# EAGLE schematic lower_pcb (EAGLE 9.6.2)
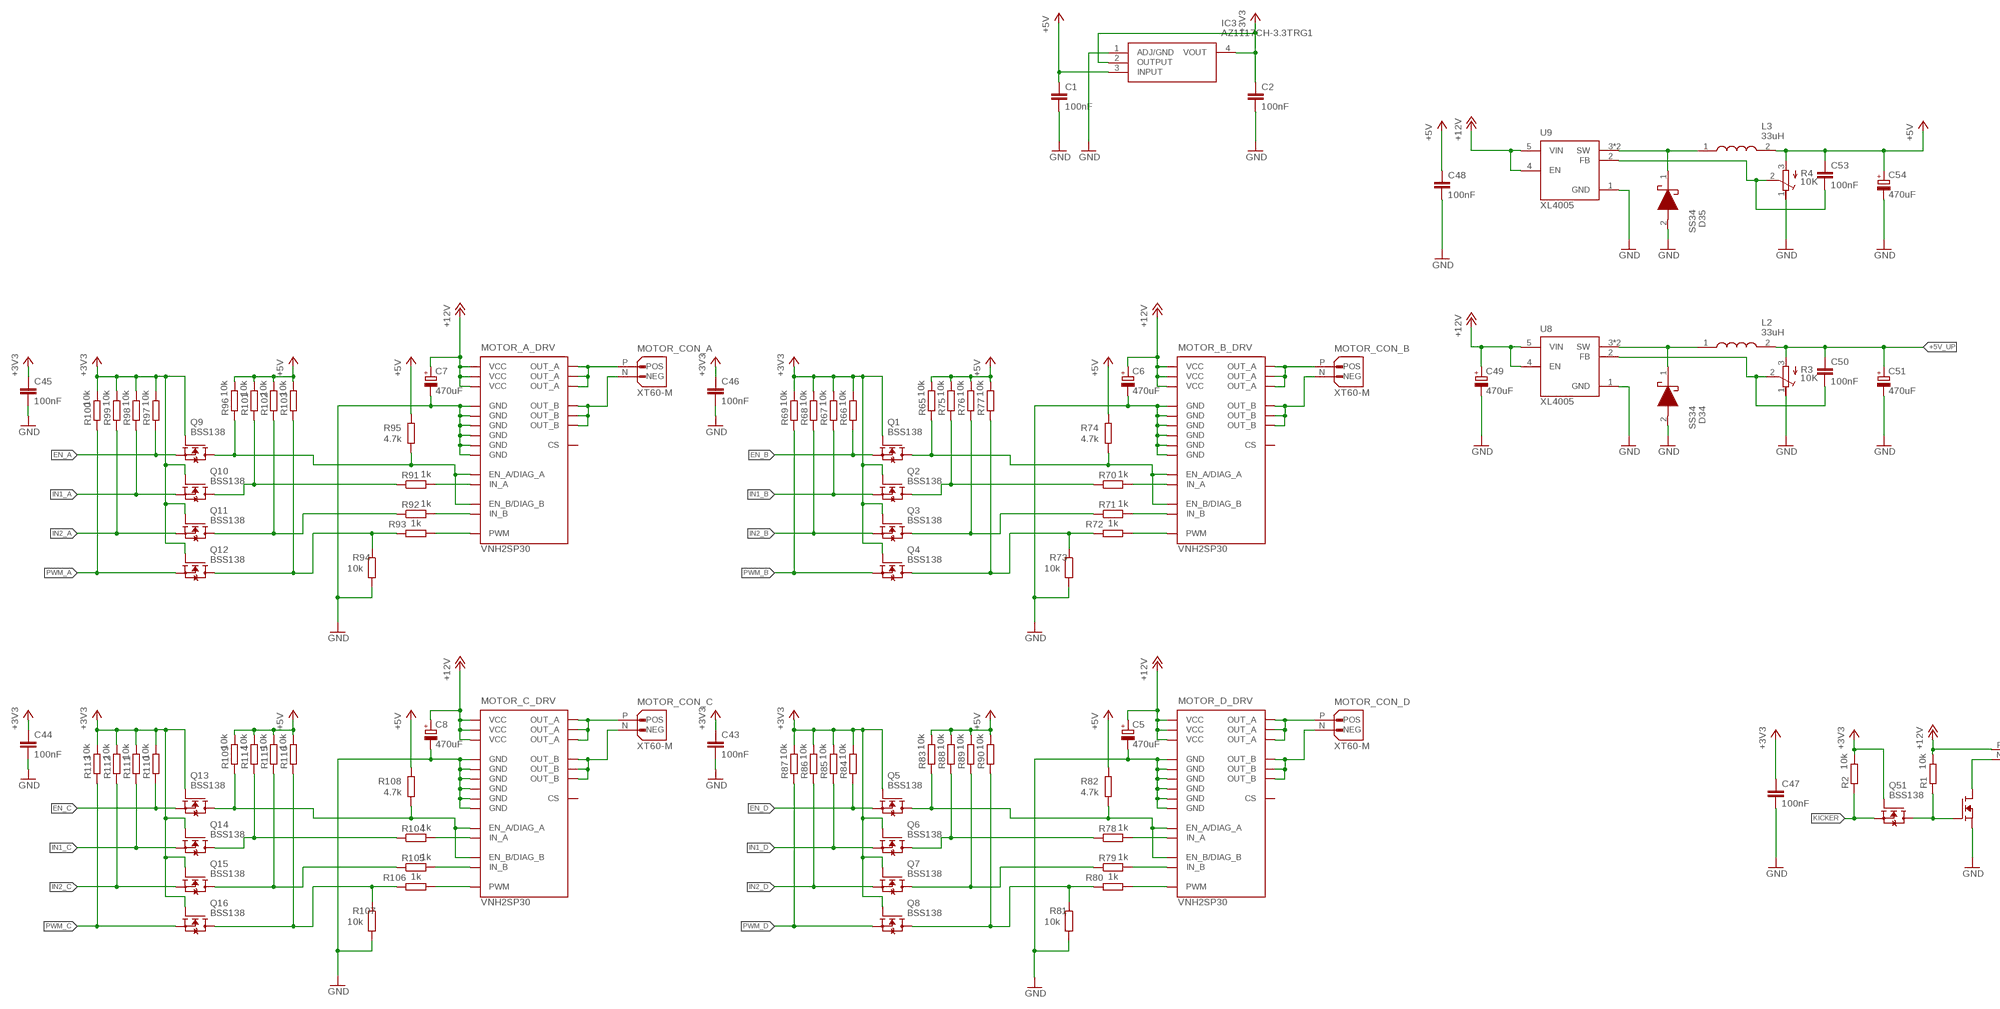
[diagram p0: schematic, sheet 1, part 1 of 2]
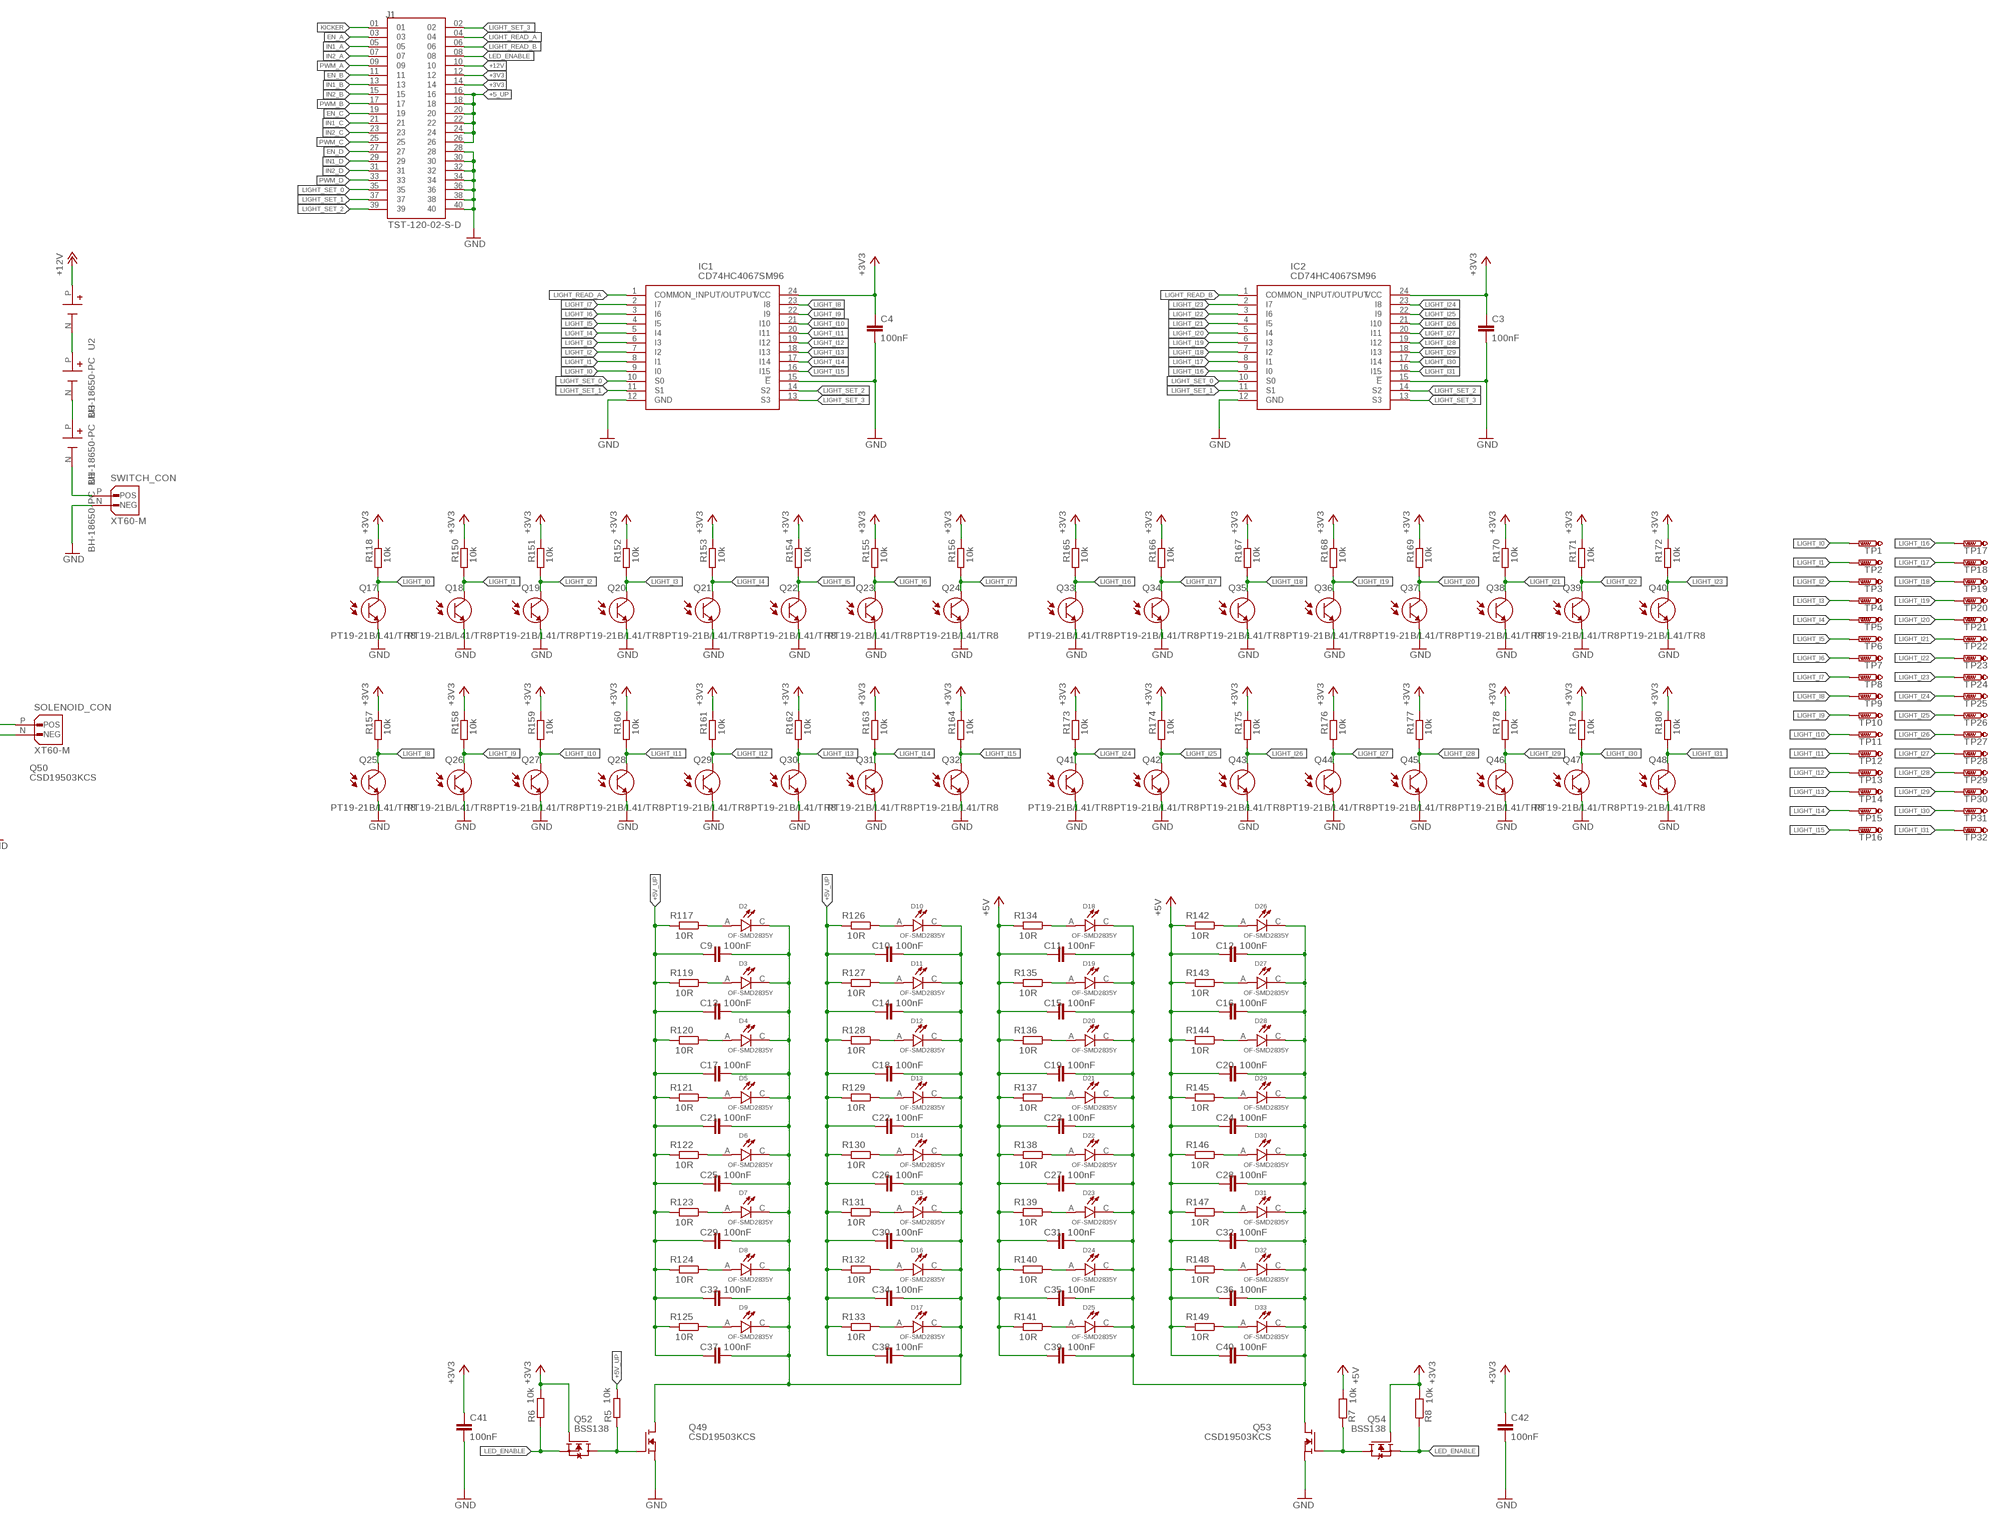
[diagram p1: schematic, sheet 1, part 2 of 2]

## Parts
C1  100nF  C-EUC0805  [C0805]
C2  100nF  C-EUC0805  [C0805]
C3  100nF  C-EUC0805  [C0805]
C4  100nF  C-EUC0805  [C0805]
C5  470uF  CPOL-EU150CLZ-1010  [150CLZ-1010]
C6  470uF  CPOL-EU150CLZ-1010  [150CLZ-1010]
C7  470uF  CPOL-EU150CLZ-1010  [150CLZ-1010]
C8  470uF  CPOL-EU150CLZ-1010  [150CLZ-1010]
C9  100nF  C-EUC0805  [C0805]
C10  100nF  C-EUC0805  [C0805]
C11  100nF  C-EUC0805  [C0805]
C12  100nF  C-EUC0805  [C0805]
C13  100nF  C-EUC0805  [C0805]
C14  100nF  C-EUC0805  [C0805]
C15  100nF  C-EUC0805  [C0805]
C16  100nF  C-EUC0805  [C0805]
C17  100nF  C-EUC0805  [C0805]
C18  100nF  C-EUC0805  [C0805]
C19  100nF  C-EUC0805  [C0805]
C20  100nF  C-EUC0805  [C0805]
C21  100nF  C-EUC0805  [C0805]
C22  100nF  C-EUC0805  [C0805]
C23  100nF  C-EUC0805  [C0805]
C24  100nF  C-EUC0805  [C0805]
C25  100nF  C-EUC0805  [C0805]
C26  100nF  C-EUC0805  [C0805]
C27  100nF  C-EUC0805  [C0805]
C28  100nF  C-EUC0805  [C0805]
C29  100nF  C-EUC0805  [C0805]
C30  100nF  C-EUC0805  [C0805]
C31  100nF  C-EUC0805  [C0805]
C32  100nF  C-EUC0805  [C0805]
C33  100nF  C-EUC0805  [C0805]
C34  100nF  C-EUC0805  [C0805]
C35  100nF  C-EUC0805  [C0805]
C36  100nF  C-EUC0805  [C0805]
C37  100nF  C-EUC0805  [C0805]
C38  100nF  C-EUC0805  [C0805]
C39  100nF  C-EUC0805  [C0805]
C40  100nF  C-EUC0805  [C0805]
C41  100nF  C-EUC0805  [C0805]
C42  100nF  C-EUC0805  [C0805]
C43  100nF  C-EUC0805  [C0805]
C44  100nF  C-EUC0805  [C0805]
C45  100nF  C-EUC0805  [C0805]
C46  100nF  C-EUC0805  [C0805]
C47  100nF  C-EUC0805  [C0805]
C48  100nF  C-EUC0805  [C0805]
C49  470uF  CPOL-EU150CLZ-1010  [150CLZ-1010]
C50  100nF  C-EUC0805  [C0805]
C51  470uF  CPOL-EU150CLZ-1010  [150CLZ-1010]
C53  100nF  C-EUC0805  [C0805]
C54  470uF  CPOL-EU150CLZ-1010  [150CLZ-1010]
D2  OF-SMD2835Y  [LED_OF-SMD2835Y]
D3  OF-SMD2835Y  [LED_OF-SMD2835Y]
D4  OF-SMD2835Y  [LED_OF-SMD2835Y]
D5  OF-SMD2835Y  [LED_OF-SMD2835Y]
D6  OF-SMD2835Y  [LED_OF-SMD2835Y]
D7  OF-SMD2835Y  [LED_OF-SMD2835Y]
D8  OF-SMD2835Y  [LED_OF-SMD2835Y]
D9  OF-SMD2835Y  [LED_OF-SMD2835Y]
D10  OF-SMD2835Y  [LED_OF-SMD2835Y]
D11  OF-SMD2835Y  [LED_OF-SMD2835Y]
D12  OF-SMD2835Y  [LED_OF-SMD2835Y]
D13  OF-SMD2835Y  [LED_OF-SMD2835Y]
D14  OF-SMD2835Y  [LED_OF-SMD2835Y]
D15  OF-SMD2835Y  [LED_OF-SMD2835Y]
D16  OF-SMD2835Y  [LED_OF-SMD2835Y]
D17  OF-SMD2835Y  [LED_OF-SMD2835Y]
D18  OF-SMD2835Y  [LED_OF-SMD2835Y]
D19  OF-SMD2835Y  [LED_OF-SMD2835Y]
D20  OF-SMD2835Y  [LED_OF-SMD2835Y]
D21  OF-SMD2835Y  [LED_OF-SMD2835Y]
D22  OF-SMD2835Y  [LED_OF-SMD2835Y]
D23  OF-SMD2835Y  [LED_OF-SMD2835Y]
D24  OF-SMD2835Y  [LED_OF-SMD2835Y]
D25  OF-SMD2835Y  [LED_OF-SMD2835Y]
D26  OF-SMD2835Y  [LED_OF-SMD2835Y]
D27  OF-SMD2835Y  [LED_OF-SMD2835Y]
D28  OF-SMD2835Y  [LED_OF-SMD2835Y]
D29  OF-SMD2835Y  [LED_OF-SMD2835Y]
D30  OF-SMD2835Y  [LED_OF-SMD2835Y]
D31  OF-SMD2835Y  [LED_OF-SMD2835Y]
D32  OF-SMD2835Y  [LED_OF-SMD2835Y]
D33  OF-SMD2835Y  [LED_OF-SMD2835Y]
D34  SS34  [DIOM8059X256N]
D35  SS34  [DIOM8059X256N]
IC1  CD74HC4067SM96  [SOP65P780X200-24N]
IC2  CD74HC4067SM96  [SOP65P780X200-24N]
IC3  AZ1117CH-3.3TRG1  [SOT230P700X180-4N]
J1  TST-120-02-S-D  [SAMTEC_TST-120-02-S-D]
L2  33uH  7443551151  [WE-HCI_1350/136523]
L3  33uH  7443551151  [WE-HCI_1350/136523]
MOTOR_A_DRV  VNH2SP30  [MULTIPOWER30]
MOTOR_B_DRV  VNH2SP30  [MULTIPOWER30]
MOTOR_C_DRV  VNH2SP30  [MULTIPOWER30]
MOTOR_CON_A  XT60-M  [AMASS_XT60-M]
MOTOR_CON_B  XT60-M  [AMASS_XT60-M]
MOTOR_CON_C  XT60-M  [AMASS_XT60-M]
MOTOR_CON_D  XT60-M  [AMASS_XT60-M]
MOTOR_D_DRV  VNH2SP30  [MULTIPOWER30]
Q1  BSS138  [SOT95P240X111-3N]
Q2  BSS138  [SOT95P240X111-3N]
Q3  BSS138  [SOT95P240X111-3N]
Q4  BSS138  [SOT95P240X111-3N]
Q5  BSS138  [SOT95P240X111-3N]
Q6  BSS138  [SOT95P240X111-3N]
Q7  BSS138  [SOT95P240X111-3N]
Q8  BSS138  [SOT95P240X111-3N]
Q9  BSS138  [SOT95P240X111-3N]
Q10  BSS138  [SOT95P240X111-3N]
Q11  BSS138  [SOT95P240X111-3N]
Q12  BSS138  [SOT95P240X111-3N]
Q13  BSS138  [SOT95P240X111-3N]
Q14  BSS138  [SOT95P240X111-3N]
Q15  BSS138  [SOT95P240X111-3N]
Q16  BSS138  [SOT95P240X111-3N]
Q17  PT19-21B/L41/TR8  [XDCR_PT19-21B/L41/TR8]
Q18  PT19-21B/L41/TR8  [XDCR_PT19-21B/L41/TR8]
Q19  PT19-21B/L41/TR8  [XDCR_PT19-21B/L41/TR8]
Q20  PT19-21B/L41/TR8  [XDCR_PT19-21B/L41/TR8]
Q21  PT19-21B/L41/TR8  [XDCR_PT19-21B/L41/TR8]
Q22  PT19-21B/L41/TR8  [XDCR_PT19-21B/L41/TR8]
Q23  PT19-21B/L41/TR8  [XDCR_PT19-21B/L41/TR8]
Q24  PT19-21B/L41/TR8  [XDCR_PT19-21B/L41/TR8]
Q25  PT19-21B/L41/TR8  [XDCR_PT19-21B/L41/TR8]
Q26  PT19-21B/L41/TR8  [XDCR_PT19-21B/L41/TR8]
Q27  PT19-21B/L41/TR8  [XDCR_PT19-21B/L41/TR8]
Q28  PT19-21B/L41/TR8  [XDCR_PT19-21B/L41/TR8]
Q29  PT19-21B/L41/TR8  [XDCR_PT19-21B/L41/TR8]
Q30  PT19-21B/L41/TR8  [XDCR_PT19-21B/L41/TR8]
Q31  PT19-21B/L41/TR8  [XDCR_PT19-21B/L41/TR8]
Q32  PT19-21B/L41/TR8  [XDCR_PT19-21B/L41/TR8]
Q33  PT19-21B/L41/TR8  [XDCR_PT19-21B/L41/TR8]
Q34  PT19-21B/L41/TR8  [XDCR_PT19-21B/L41/TR8]
Q35  PT19-21B/L41/TR8  [XDCR_PT19-21B/L41/TR8]
Q36  PT19-21B/L41/TR8  [XDCR_PT19-21B/L41/TR8]
Q37  PT19-21B/L41/TR8  [XDCR_PT19-21B/L41/TR8]
Q38  PT19-21B/L41/TR8  [XDCR_PT19-21B/L41/TR8]
Q39  PT19-21B/L41/TR8  [XDCR_PT19-21B/L41/TR8]
Q40  PT19-21B/L41/TR8  [XDCR_PT19-21B/L41/TR8]
Q41  PT19-21B/L41/TR8  [XDCR_PT19-21B/L41/TR8]
Q42  PT19-21B/L41/TR8  [XDCR_PT19-21B/L41/TR8]
Q43  PT19-21B/L41/TR8  [XDCR_PT19-21B/L41/TR8]
Q44  PT19-21B/L41/TR8  [XDCR_PT19-21B/L41/TR8]
Q45  PT19-21B/L41/TR8  [XDCR_PT19-21B/L41/TR8]
Q46  PT19-21B/L41/TR8  [XDCR_PT19-21B/L41/TR8]
Q47  PT19-21B/L41/TR8  [XDCR_PT19-21B/L41/TR8]
Q48  PT19-21B/L41/TR8  [XDCR_PT19-21B/L41/TR8]
Q49  CSD19503KCS  [TO254P1036X470X1965-3]
Q50  CSD19503KCS  [TO254P1036X470X1965-3]
Q51  BSS138  [SOT95P240X111-3N]
Q52  BSS138  [SOT95P240X111-3N]
Q53  CSD19503KCS  [TO254P1036X470X1965-3]
Q54  BSS138  [SOT95P240X111-3N]
R1  10k  R-EU_R1206  [R1206]
R2  10k  R-EU_R1206  [R1206]
R3  10K  R-TRIMM3314J  [RTRIM3314J]
R4  10K  R-TRIMM3314J  [RTRIM3314J]
R5  10k  R-EU_R1206  [R1206]
R6  10k  R-EU_R1206  [R1206]
R7  10k  R-EU_R1206  [R1206]
R8  10k  R-EU_R1206  [R1206]
R65  10k  R-EU_R1206  [R1206]
R66  10k  R-EU_R1206  [R1206]
R67  10k  R-EU_R1206  [R1206]
R68  10k  R-EU_R1206  [R1206]
R69  10k  R-EU_R1206  [R1206]
R70  1k  R-EU_R1206  [R1206]
R71  1k  R-EU_R1206  [R1206]
R72  1k  R-EU_R1206  [R1206]
R73  10k  R-EU_R1206  [R1206]
R74  4.7k  R-EU_R1206  [R1206]
R75  10k  R-EU_R1206  [R1206]
R76  10k  R-EU_R1206  [R1206]
R77  10k  R-EU_R1206  [R1206]
R78  1k  R-EU_R1206  [R1206]
R79  1k  R-EU_R1206  [R1206]
R80  1k  R-EU_R1206  [R1206]
R81  10k  R-EU_R1206  [R1206]
R82  4.7k  R-EU_R1206  [R1206]
R83  10k  R-EU_R1206  [R1206]
R84  10k  R-EU_R1206  [R1206]
R85  10k  R-EU_R1206  [R1206]
R86  10k  R-EU_R1206  [R1206]
R87  10k  R-EU_R1206  [R1206]
R88  10k  R-EU_R1206  [R1206]
R89  10k  R-EU_R1206  [R1206]
R90  10k  R-EU_R1206  [R1206]
R91  1k  R-EU_R1206  [R1206]
R92  1k  R-EU_R1206  [R1206]
R93  1k  R-EU_R1206  [R1206]
R94  10k  R-EU_R1206  [R1206]
R95  4.7k  R-EU_R1206  [R1206]
R96  10k  R-EU_R1206  [R1206]
R97  10k  R-EU_R1206  [R1206]
R98  10k  R-EU_R1206  [R1206]
R99  10k  R-EU_R1206  [R1206]
R100  10k  R-EU_R1206  [R1206]
R101  10k  R-EU_R1206  [R1206]
R102  10k  R-EU_R1206  [R1206]
R103  10k  R-EU_R1206  [R1206]
R104  1k  R-EU_R1206  [R1206]
R105  1k  R-EU_R1206  [R1206]
R106  1k  R-EU_R1206  [R1206]
R107  10k  R-EU_R1206  [R1206]
R108  4.7k  R-EU_R1206  [R1206]
R109  10k  R-EU_R1206  [R1206]
R110  10k  R-EU_R1206  [R1206]
R111  10k  R-EU_R1206  [R1206]
R112  10k  R-EU_R1206  [R1206]
R113  10k  R-EU_R1206  [R1206]
R114  10k  R-EU_R1206  [R1206]
R115  10k  R-EU_R1206  [R1206]
R116  10k  R-EU_R1206  [R1206]
R117  10R  R-EU_R1206  [R1206]
R118  10k  R-EU_R1206  [R1206]
R119  10R  R-EU_R1206  [R1206]
R120  10R  R-EU_R1206  [R1206]
R121  10R  R-EU_R1206  [R1206]
R122  10R  R-EU_R1206  [R1206]
R123  10R  R-EU_R1206  [R1206]
R124  10R  R-EU_R1206  [R1206]
R125  10R  R-EU_R1206  [R1206]
R126  10R  R-EU_R1206  [R1206]
R127  10R  R-EU_R1206  [R1206]
R128  10R  R-EU_R1206  [R1206]
R129  10R  R-EU_R1206  [R1206]
R130  10R  R-EU_R1206  [R1206]
R131  10R  R-EU_R1206  [R1206]
R132  10R  R-EU_R1206  [R1206]
R133  10R  R-EU_R1206  [R1206]
R134  10R  R-EU_R1206  [R1206]
R135  10R  R-EU_R1206  [R1206]
R136  10R  R-EU_R1206  [R1206]
R137  10R  R-EU_R1206  [R1206]
R138  10R  R-EU_R1206  [R1206]
R139  10R  R-EU_R1206  [R1206]
R140  10R  R-EU_R1206  [R1206]
R141  10R  R-EU_R1206  [R1206]
R142  10R  R-EU_R1206  [R1206]
R143  10R  R-EU_R1206  [R1206]
R144  10R  R-EU_R1206  [R1206]
R145  10R  R-EU_R1206  [R1206]
R146  10R  R-EU_R1206  [R1206]
R147  10R  R-EU_R1206  [R1206]
R148  10R  R-EU_R1206  [R1206]
R149  10R  R-EU_R1206  [R1206]
R150  10k  R-EU_R1206  [R1206]
R151  10k  R-EU_R1206  [R1206]
R152  10k  R-EU_R1206  [R1206]
R153  10k  R-EU_R1206  [R1206]
R154  10k  R-EU_R1206  [R1206]
R155  10k  R-EU_R1206  [R1206]
R156  10k  R-EU_R1206  [R1206]
R157  10k  R-EU_R1206  [R1206]
R158  10k  R-EU_R1206  [R1206]
R159  10k  R-EU_R1206  [R1206]
R160  10k  R-EU_R1206  [R1206]
R161  10k  R-EU_R1206  [R1206]
R162  10k  R-EU_R1206  [R1206]
R163  10k  R-EU_R1206  [R1206]
R164  10k  R-EU_R1206  [R1206]
R165  10k  R-EU_R1206  [R1206]
R166  10k  R-EU_R1206  [R1206]
R167  10k  R-EU_R1206  [R1206]
R168  10k  R-EU_R1206  [R1206]
R169  10k  R-EU_R1206  [R1206]
R170  10k  R-EU_R1206  [R1206]
R171  10k  R-EU_R1206  [R1206]
R172  10k  R-EU_R1206  [R1206]
R173  10k  R-EU_R1206  [R1206]
R174  10k  R-EU_R1206  [R1206]
R175  10k  R-EU_R1206  [R1206]
R176  10k  R-EU_R1206  [R1206]
R177  10k  R-EU_R1206  [R1206]
R178  10k  R-EU_R1206  [R1206]
R179  10k  R-EU_R1206  [R1206]
R180  10k  R-EU_R1206  [R1206]
SOLENOID_CON  XT60-M  [AMASS_XT60-M]
SWITCH_CON  XT60-M  [AMASS_XT60-M]
TP1  PTR1PAD1-13  [P1-13]
TP2  PTR1PAD1-13  [P1-13]
TP3  PTR1PAD1-13  [P1-13]
TP4  PTR1PAD1-13  [P1-13]
TP5  PTR1PAD1-13  [P1-13]
TP6  PTR1PAD1-13  [P1-13]
TP7  PTR1PAD1-13  [P1-13]
TP8  PTR1PAD1-13  [P1-13]
TP9  PTR1PAD1-13  [P1-13]
TP10  PTR1PAD1-13  [P1-13]
TP11  PTR1PAD1-13  [P1-13]
TP12  PTR1PAD1-13  [P1-13]
TP13  PTR1PAD1-13  [P1-13]
TP14  PTR1PAD1-13  [P1-13]
TP15  PTR1PAD1-13  [P1-13]
TP16  PTR1PAD1-13  [P1-13]
TP17  PTR1PAD1-13  [P1-13]
TP18  PTR1PAD1-13  [P1-13]
TP19  PTR1PAD1-13  [P1-13]
TP20  PTR1PAD1-13  [P1-13]
TP21  PTR1PAD1-13  [P1-13]
TP22  PTR1PAD1-13  [P1-13]
TP23  PTR1PAD1-13  [P1-13]
TP24  PTR1PAD1-13  [P1-13]
TP25  PTR1PAD1-13  [P1-13]
TP26  PTR1PAD1-13  [P1-13]
TP27  PTR1PAD1-13  [P1-13]
TP28  PTR1PAD1-13  [P1-13]
TP29  PTR1PAD1-13  [P1-13]
TP30  PTR1PAD1-13  [P1-13]
TP31  PTR1PAD1-13  [P1-13]
TP32  PTR1PAD1-13  [P1-13]
U1  BH-18650-PC  [BAT_BH-18650-PC]
U2  BH-18650-PC  [BAT_BH-18650-PC]
U3  BH-18650-PC  [BAT_BH-18650-PC]
U8  XL4005  XL4015  [CONV_XL4015]
U9  XL4005  XL4015  [CONV_XL4015]

## Nets
+3V3: C2.1 C3.1 C4.1 C41.1 C42.1 C43.1 C44.1 C45.1 C46.1 C47.1 IC1.24(VCC) IC2.24(VCC) IC3.2(OUTPUT) IC3.4(VOUT) J1.12 J1.14 Q1.1(G) Q2.1(G) Q3.1(G) Q4.1(G) Q5.1(G) Q6.1(G) Q7.1(G) Q8.1(G) Q9.1(G) Q10.1(G) Q11.1(G) Q12.1(G) Q13.1(G) Q14.1(G) Q15.1(G) Q16.1(G) Q51.1(G) Q52.1(G) Q54.1(G) R2.2 R6.2 R8.2 R66.2 R67.2 R68.2 R69.2 R84.2 R85.2 R86.2 R87.2 R97.2 R98.2 R99.2 R100.2 R110.2 R111.2 R112.2 R113.2 R118.1 R150.1 R151.1 R152.1 R153.1 R154.1 R155.1 R156.1 R157.1 R158.1 R159.1 R160.1 R161.1 R162.1 R163.1 R164.1 R165.1 R166.1 R167.1 R168.1 R169.1 R170.1 R171.1 R172.1 R173.1 R174.1 R175.1 R176.1 R177.1 R178.1 R179.1 R180.1
+5_UP: J1.16 J1.18 J1.20 J1.22 J1.24 J1.26
+5V: C1.1 C11.2 C12.2 C15.2 C16.2 C19.2 C20.2 C23.2 C24.2 C27.2 C28.2 C31.2 C32.2 C35.2 C36.2 C39.2 C40.2 C48.1 C53.1 C54.+ IC3.3(INPUT) L3.2 R4.3(A) R7.2 R65.2 R74.2 R75.2 R76.2 R77.2 R82.2 R83.2 R88.2 R89.2 R90.2 R95.2 R96.2 R101.2 R102.2 R103.2 R108.2 R109.2 R114.2 R115.2 R116.2 R134.2 R135.2 R136.2 R137.2 R138.2 R139.2 R140.2 R141.2 R142.2 R143.2 R144.2 R145.2 R146.2 R147.2 R148.2 R149.2
+5V_UP: C9.2 C10.2 C13.2 C14.2 C17.2 C18.2 C21.2 C22.2 C25.2 C26.2 C29.2 C30.2 C33.2 C34.2 C37.2 C38.2 C50.1 C51.+ L2.2 R3.3(A) R5.2 R117.2 R119.2 R120.2 R121.2 R122.2 R123.2 R124.2 R125.2 R126.2 R127.2 R128.2 R129.2 R130.2 R131.2 R132.2 R133.2
+12V: C5.+ C6.+ C7.+ C8.+ C49.+ J1.10 MOTOR_A_DRV.P$3(VCC) MOTOR_A_DRV.P$13(VCC) MOTOR_A_DRV.P$23(VCC) MOTOR_B_DRV.P$3(VCC) MOTOR_B_DRV.P$13(VCC) MOTOR_B_DRV.P$23(VCC) MOTOR_C_DRV.P$3(VCC) MOTOR_C_DRV.P$13(VCC) MOTOR_C_DRV.P$23(VCC) MOTOR_D_DRV.P$3(VCC) MOTOR_D_DRV.P$13(VCC) MOTOR_D_DRV.P$23(VCC) R1.2 SOLENOID_CON.P(POS) U2.P(+) U8.4(EN) U8.5(VIN) U9.4(EN) U9.5(VIN)
EN_A: J1.03 Q9.2(S) R97.1
EN_B: J1.11 Q1.2(S) R66.1
EN_C: J1.19 Q13.2(S) R110.1
EN_D: J1.27 Q5.2(S) R84.1
GND: C1.2 C2.2 C3.2 C4.2 C5.- C6.- C7.- C8.- C41.2 C42.2 C43.2 C44.2 C45.2 C46.2 C47.2 C48.2 C49.- C51.- C54.- D34.2(A) D35.2(A) IC1.12(GND) IC1.15(!E) IC2.12(GND) IC2.15(!E) IC3.1(ADJ/GND) J1.28 J1.30 J1.32 J1.34 J1.36 J1.38 J1.40 MOTOR_A_DRV.P$18(GND) MOTOR_A_DRV.P$19(GND) MOTOR_A_DRV.P$20(GND) MOTOR_A_DRV.P$26(GND) MOTOR_A_DRV.P$27(GND) MOTOR_A_DRV.P$28(GND) MOTOR_B_DRV.P$18(GND) MOTOR_B_DRV.P$19(GND) MOTOR_B_DRV.P$20(GND) MOTOR_B_DRV.P$26(GND) MOTOR_B_DRV.P$27(GND) MOTOR_B_DRV.P$28(GND) MOTOR_C_DRV.P$18(GND) MOTOR_C_DRV.P$19(GND) MOTOR_C_DRV.P$20(GND) MOTOR_C_DRV.P$26(GND) MOTOR_C_DRV.P$27(GND) MOTOR_C_DRV.P$28(GND) MOTOR_D_DRV.P$18(GND) MOTOR_D_DRV.P$19(GND) MOTOR_D_DRV.P$20(GND) MOTOR_D_DRV.P$26(GND) MOTOR_D_DRV.P$27(GND) MOTOR_D_DRV.P$28(GND) Q17.E Q18.E Q19.E Q20.E Q21.E Q22.E Q23.E Q24.E Q25.E Q26.E Q27.E Q28.E Q29.E Q30.E Q31.E Q32.E Q33.E Q34.E Q35.E Q36.E Q37.E Q38.E Q39.E Q40.E Q41.E Q42.E Q43.E Q44.E Q45.E Q46.E Q47.E Q48.E Q49.3(S) Q50.3(S) Q53.3(S) R3.1(E) R4.1(E) R73.2 R81.2 R94.2 R107.2 SWITCH_CON.N(NEG) U8.1(GND) U9.1(GND)
IN1_A: J1.05 Q10.2(S) R98.1
IN1_B: J1.13 Q2.2(S) R67.1
IN1_C: J1.21 Q14.2(S) R111.1
IN1_D: J1.29 Q6.2(S) R85.1
IN2_A: J1.07 Q11.2(S) R99.1
IN2_B: J1.15 Q3.2(S) R68.1
IN2_C: J1.23 Q15.2(S) R112.1
IN2_D: J1.31 Q7.2(S) R86.1
KICKER: J1.01 Q51.2(S) R2.1
LED_ENABLE: J1.08 Q52.2(S) Q54.2(S) R6.1 R8.1
LIGHT_I0: IC1.9(I0) Q17.C R118.2 TP1.TP
LIGHT_I1: IC1.8(I1) Q18.C R150.2 TP2.TP
LIGHT_I2: IC1.7(I2) Q19.C R151.2 TP3.TP
LIGHT_I3: IC1.6(I3) Q20.C R152.2 TP4.TP
LIGHT_I4: IC1.5(I4) Q21.C R153.2 TP5.TP
LIGHT_I5: IC1.4(I5) Q22.C R154.2 TP6.TP
LIGHT_I6: IC1.3(I6) Q23.C R155.2 TP7.TP
LIGHT_I7: IC1.2(I7) Q24.C R156.2 TP8.TP
LIGHT_I8: IC1.23(I8) Q25.C R157.2 TP9.TP
LIGHT_I9: IC1.22(I9) Q26.C R158.2 TP10.TP
LIGHT_I10: IC1.21(I10) Q27.C R159.2 TP11.TP
LIGHT_I11: IC1.20(I11) Q28.C R160.2 TP12.TP
LIGHT_I12: IC1.19(I12) Q29.C R161.2 TP13.TP
LIGHT_I13: IC1.18(I13) Q30.C R162.2 TP14.TP
LIGHT_I14: IC1.17(I14) Q31.C R163.2 TP15.TP
LIGHT_I15: IC1.16(I15) Q32.C R164.2 TP16.TP
LIGHT_I16: IC2.9(I0) Q33.C R165.2 TP17.TP
LIGHT_I17: IC2.8(I1) Q34.C R166.2 TP18.TP
LIGHT_I18: IC2.7(I2) Q35.C R167.2 TP19.TP
LIGHT_I19: IC2.6(I3) Q36.C R168.2 TP20.TP
LIGHT_I20: IC2.5(I4) Q37.C R169.2 TP21.TP
LIGHT_I21: IC2.4(I5) Q38.C R170.2 TP22.TP
LIGHT_I22: IC2.3(I6) Q39.C R171.2 TP23.TP
LIGHT_I23: IC2.2(I7) Q40.C R172.2 TP24.TP
LIGHT_I24: IC2.23(I8) Q41.C R173.2 TP25.TP
LIGHT_I25: IC2.22(I9) Q42.C R174.2 TP26.TP
LIGHT_I26: IC2.21(I10) Q43.C R175.2 TP27.TP
LIGHT_I27: IC2.20(I11) Q44.C R176.2 TP28.TP
LIGHT_I28: IC2.19(I12) Q45.C R177.2 TP29.TP
LIGHT_I29: IC2.18(I13) Q46.C R178.2 TP30.TP
LIGHT_I30: IC2.17(I14) Q47.C R179.2 TP31.TP
LIGHT_I31: IC2.16(I15) Q48.C R180.2 TP32.TP
LIGHT_READ_A: IC1.1(COMMON_INPUT/OUTPUT) J1.04
LIGHT_READ_B: IC2.1(COMMON_INPUT/OUTPUT) J1.06
LIGHT_SET_0: IC1.10(S0) IC2.10(S0) J1.35
LIGHT_SET_1: IC1.11(S1) IC2.11(S1) J1.37
LIGHT_SET_2: IC1.14(S2) IC2.14(S2) J1.39
LIGHT_SET_3: IC1.13(S3) IC2.13(S3) J1.02
N$1: Q50.2(D) SOLENOID_CON.N(NEG)
N$2: Q50.1(G) Q51.3(D) R1.1
N$3: D34.1(K) L2.1 U8.3(SW) U8.3.1(SW)
N$4: D35.1(K) L3.1 U9.3(SW) U9.3.1(SW)
N$5: C50.2 R3.2(S) U8.2(FB)
N$6: C53.2 R4.2(S) U9.2(FB)
N$7: U2.N(-) U3.P(+)
N$8: U1.P(+) U3.N(-)
N$9: SWITCH_CON.P(POS) U1.N(-)
N$10: Q49.1(G) Q52.3(D) R5.1
N$12: Q53.1(G) Q54.3(D) R7.1
N$14: C9.1 C10.1 C13.1 C14.1 C17.1 C18.1 C21.1 C22.1 C25.1 C26.1 C29.1 C30.1 C33.1 C34.1 C37.1 C38.1 D2.C D3.C D4.C D5.C D6.C D7.C D8.C D9.C D10.C D11.C D12.C D13.C D14.C D15.C D16.C D17.C Q49.2(D)
N$17: C11.1 C12.1 C15.1 C16.1 C19.1 C20.1 C23.1 C24.1 C27.1 C28.1 C31.1 C32.1 C35.1 C36.1 C39.1 C40.1 D18.C D19.C D20.C D21.C D22.C D23.C D24.C D25.C D26.C D27.C D28.C D29.C D30.C D31.C D32.C D33.C Q53.2(D)
N$33: MOTOR_CON_D.P(POS) MOTOR_D_DRV.P$1(OUT_A) MOTOR_D_DRV.P$25(OUT_A) MOTOR_D_DRV.P$30(OUT_A)
N$34: MOTOR_CON_D.N(NEG) MOTOR_D_DRV.P$15(OUT_B) MOTOR_D_DRV.P$16(OUT_B) MOTOR_D_DRV.P$21(OUT_B)
N$35: MOTOR_D_DRV.P$8(PWM) R80.1
N$37: MOTOR_B_DRV.P$1(OUT_A) MOTOR_B_DRV.P$25(OUT_A) MOTOR_B_DRV.P$30(OUT_A) MOTOR_CON_B.P(POS)
N$38: MOTOR_D_DRV.P$11(IN_B) R79.2
N$39: MOTOR_D_DRV.P$5(IN_A) R78.2
N$40: MOTOR_B_DRV.P$15(OUT_B) MOTOR_B_DRV.P$16(OUT_B) MOTOR_B_DRV.P$21(OUT_B) MOTOR_CON_B.N(NEG)
N$41: MOTOR_B_DRV.P$8(PWM) R72.1
N$42: MOTOR_B_DRV.P$11(IN_B) R71.2
N$43: MOTOR_B_DRV.P$5(IN_A) R70.2
N$45: Q6.3(D) R78.1 R88.1
N$46: Q7.3(D) R79.1 R89.1
N$47: Q8.3(D) R80.2 R81.1 R90.1
N$48: MOTOR_D_DRV.P$6(EN_A/DIAG_A) MOTOR_D_DRV.P$10(EN_B/DIAG_B) Q5.3(D) R82.1 R83.1
N$49: MOTOR_A_DRV.P$1(OUT_A) MOTOR_A_DRV.P$25(OUT_A) MOTOR_A_DRV.P$30(OUT_A) MOTOR_CON_A.P(POS)
N$50: MOTOR_A_DRV.P$15(OUT_B) MOTOR_A_DRV.P$16(OUT_B) MOTOR_A_DRV.P$21(OUT_B) MOTOR_CON_A.N(NEG)
N$51: MOTOR_A_DRV.P$8(PWM) R93.1
N$52: MOTOR_A_DRV.P$11(IN_B) R92.2
N$53: MOTOR_A_DRV.P$5(IN_A) R91.2
N$56: Q10.3(D) R91.1 R101.1
N$57: Q11.3(D) R92.1 R102.1
N$58: Q12.3(D) R93.2 R94.1 R103.1
N$59: MOTOR_A_DRV.P$6(EN_A/DIAG_A) MOTOR_A_DRV.P$10(EN_B/DIAG_B) Q9.3(D) R95.1 R96.1
N$60: MOTOR_C_DRV.P$1(OUT_A) MOTOR_C_DRV.P$25(OUT_A) MOTOR_C_DRV.P$30(OUT_A) MOTOR_CON_C.P(POS)
N$61: MOTOR_C_DRV.P$15(OUT_B) MOTOR_C_DRV.P$16(OUT_B) MOTOR_C_DRV.P$21(OUT_B) MOTOR_CON_C.N(NEG)
N$62: MOTOR_C_DRV.P$8(PWM) R106.1
N$63: MOTOR_C_DRV.P$11(IN_B) R105.2
N$64: MOTOR_C_DRV.P$5(IN_A) R104.2
N$66: Q14.3(D) R104.1 R114.1
N$67: Q15.3(D) R105.1 R115.1
N$68: Q16.3(D) R106.2 R107.1 R116.1
N$69: MOTOR_C_DRV.P$6(EN_A/DIAG_A) MOTOR_C_DRV.P$10(EN_B/DIAG_B) Q13.3(D) R108.1 R109.1
N$70: D2.A R117.1
N$71: D3.A R119.1
N$72: D4.A R120.1
N$73: D5.A R121.1
N$74: D6.A R122.1
N$75: D7.A R123.1
N$76: D8.A R124.1
N$77: D9.A R125.1
N$78: D10.A R126.1
N$79: D11.A R127.1
N$80: D12.A R128.1
N$81: D13.A R129.1
N$82: Q4.3(D) R72.2 R73.1 R77.1
N$83: Q3.3(D) R71.1 R76.1
N$84: Q2.3(D) R70.1 R75.1
N$85: MOTOR_B_DRV.P$6(EN_A/DIAG_A) MOTOR_B_DRV.P$10(EN_B/DIAG_B) Q1.3(D) R65.1 R74.1
N$86: D14.A R130.1
N$87: D15.A R131.1
N$88: D16.A R132.1
N$89: D17.A R133.1
N$90: D18.A R134.1
N$91: D19.A R135.1
N$92: D20.A R136.1
N$93: D21.A R137.1
N$94: D22.A R138.1
N$95: D23.A R139.1
N$96: D24.A R140.1
N$97: D25.A R141.1
N$98: D26.A R142.1
N$99: D27.A R143.1
N$100: D28.A R144.1
N$101: D29.A R145.1
N$102: D30.A R146.1
N$103: D31.A R147.1
N$104: D32.A R148.1
N$105: D33.A R149.1
PWM_A: J1.09 Q12.2(S) R100.1
PWM_B: J1.17 Q4.2(S) R69.1
PWM_C: J1.25 Q16.2(S) R113.1
PWM_D: J1.33 Q8.2(S) R87.1
Unconnected: MOTOR_A_DRV.P$9(CS) MOTOR_B_DRV.P$9(CS) MOTOR_C_DRV.P$9(CS) MOTOR_D_DRV.P$9(CS)

## Library data of the parts
C1-C4 C9-C48 C50 C53 = rcl:C-EU: CAPACITOR, European symbol; SPICEPREFIX: C
C5-C8 C49 C51 C54 = rcl:CPOL-EU: POLARIZED CAPACITOR, European symbol; SPICEPREFIX: C
D2 D4-D33 = OF-SMD2835Y:OF-SMD2835Y: LED; SMD; 2835, PLCC2; yellow; 2200-2800mcd; 2.8x3.5x0.75mm; 120° Check availability <https://pricing.snapeda.com/parts/OF-SMD2835Y/Optoflash/view-part?ref=eda>; AVAILABILITY: Not in stock; DESCRIPTION: LED; SMD; 2835, PLCC2; yellow; 2200-2800mcd; 2.8x3.5x0.75mm; 120°; MF: Optoflash; MP: OF-SMD2835Y; PACKAGE: PLCC-2 Optoflash; PRICE: None
D3 = OF-SMD2835Y:OF-SMD2835Y: LED; SMD; 2835, PLCC2; yellow; 2200-2800mcd; 2.8x3.5x0.75mm; 120° Check availability <https://pricing.snapeda.com/parts/OF-SMD2835Y/Optoflash/view-part?ref=eda>; AVAILABILITY: Not in stock; DESCRIPTION: LED; SMD; 2835, PLCC2; yellow; 2200-2800mcd; 2.8x3.5x0.75mm; 120°; MF: Optoflash; MP: OF-SMD2835Y; PACKAGE: PLCC-2 Optoflash; PRICE: None; SPICEPREFIX: D
D34 D35 = SamacSys_Parts:SS34: ON Semi SS34 SMT Schottky Diode, 40V 3A, 2-Pin DO-214AB Source: Datasheet <https://componentsearchengine.com/Datasheets/2/SS34.pdf>; DESCRIPTION: ON Semi SS34 SMT Schottky Diode, 40V 3A, 2-Pin DO-214AB; HEIGHT: 2.56mm; MANUFACTURER_NAME: onsemi; MANUFACTURER_PART_NUMBER: SS34; MOUSER_PART_NUMBER: 512-SS34; MOUSER_PRICE-STOCK: https://www.mouser.co.uk/ProductDetail/ON-Semiconductor-Fairchild/SS34?qs=2ONuHmP%2FXzb3ub11UdFfdQ%3D%3D
IC1 IC2 = SamacSys_Parts:CD74HC4067SM96: High Speed CMOS 16-Ch MUX/DEMUX 24P SOIC CD74HC4067SM96, Multiplexer/Demultiplexer Single 16:1, 3 V, 5 V, 24-Pin, SSOP, 1 Source: Datasheet <https://datasheet.datasheetarchive.com/originals/distributors/SFDatasheet-6/sf-000127204.pdf>; DESCRIPTION: High Speed CMOS 16-Ch MUX/DEMUX 24P SOIC CD74HC4067SM96, Multiplexer/Demultiplexer Single 16:1, 3 V, 5 V, 24-Pin, SSOP, 1; HEIGHT: 2mm; MANUFACTURER_NAME: Texas Instruments; MANUFACTURER_PART_NUMBER: CD74HC4067SM96; MOUSER_PART_NUMBER: 595-CD74HC4067SM96; MOUSER_PRICE-STOCK: https://www.mouser.co.uk/ProductDetail/Texas-Instruments/CD74HC4067SM96?qs=JHHQeKcAU3DyfvAOSRLjhQ%3D%3D
IC3 = AZ1117CH-3.3TRG1:AZ1117CH-3.3TRG1: 1.35A 3.3V LDO Reg. Current Limit SOT223 DiodesZetex AZ1117CH-3.3TRG1, LDO Voltage Regulator, 0.8A, 3.3 V +/-1%, maximum of 15 Vin, 3-Pin SOT-223 Source: Datasheet <https://datasheet.datasheetarchive.com/originals/distributors/Datasheets-DGA25/1776204.pdf>; DESCRIPTION: 1.35A 3.3V LDO Reg. Current Limit SOT223 DiodesZetex AZ1117CH-3.3TRG1, LDO Voltage Regulator, 0.8A, 3.3 V +/-1%, maximum of 15 Vin, 3-Pin SOT-223; HEIGHT: 1.8mm; MANUFACTURER_NAME: Diodes Inc.; MANUFACTURER_PART_NUMBER: AZ1117CH-3.3TRG1; MOUSER_PART_NUMBER: 621-AZ1117CH-3.3TRG1; MOUSER_PRICE-STOCK: https://www.mouser.co.uk/ProductDetail/Diodes-Incorporated/AZ1117CH-3.3TRG1?qs=FKu9oBikfSm7ntaG6olPSQ%3D%3D
J1 = TST-120-02-S-D:TST-120-02-S-D: Check availability <https://pricing.snapeda.com/parts/TST-120-02-S-D-20/Samtec/view-part?ref=eda>; AVAILABILITY: In Stock; DESCRIPTION: Connector Header Through Hole 40 position 0.100 (2.54mm); MF: Samtec; MP: TST-120-02-S-D-20; PACKAGE: None; PRICE: None; PURCHASE-URL: https://pricing.snapeda.com/search/part/TST-120-02-S-D-20/?ref=eda
L2 L3 = SamacSys_Parts:7443551151: Wurth WE-HCI Series Shielded Wire-wound SMD Inductor with a WE-Perm Core, 15.4 uH +/-20% Flat Wire Winding 9A Idc Source: Datasheet; DESCRIPTION: Wurth WE-HCI Series Shielded Wire-wound SMD Inductor with a WE-Perm Core, 15.4 uH +/-20% Flat Wire Winding 9A Idc; HEIGHT: mm; MANUFACTURER_NAME: Wurth Elektronik; MANUFACTURER_PART_NUMBER: 7443551151; MOUSER_PART_NUMBER: 710-7443551151; MOUSER_PRICE-STOCK: https://www.mouser.co.uk/ProductDetail/Wurth-Elektronik/7443551151?qs=rS3zZhy2AQNp31%2FseN5Xyg%3D%3D
MOTOR_A_DRV MOTOR_B_DRV MOTOR_C_DRV MOTOR_D_DRV = VNH2SP30:VNH2SP30: Check availability <https://pricing.snapeda.com/parts/VNH2SP30/STMicroelectronics/view-part?ref=eda>; AVAILABILITY: In Stock; DESCRIPTION: - Motor Driver Power MOSFET PWM MultiPowerSO-30; MF: STMicroelectronics; MP: VNH2SP30; PACKAGE: DIP-18 STMicroelectronics; PRICE: None; PURCHASE-URL: https://pricing.snapeda.com/search/part/VNH2SP30/?ref=eda; SPICEPREFIX: X
MOTOR_CON_A MOTOR_CON_B MOTOR_CON_C MOTOR_CON_D SOLENOID_CON SWITCH_CON = XT60-M:XT60-M: Check availability <https://pricing.snapeda.com/parts/XT60-M/AMASS/view-part?ref=eda>; AVAILABILITY: Not in stock; DESCRIPTION: Plug; DC supply; XT60; male; PIN: 2; for cable; soldered; 30A; 500V; MF: AMASS; MP: XT60-M; PACKAGE: Package; PRICE: None
Q1-Q16 Q51 Q52 Q54 = BSS138:BSS138: N-Channel 50V 220mA (Ta) 360mW (Ta) Surface Mount SOT-23-3 Check availability <https://pricing.snapeda.com/parts/BSS138/ON%20Semiconductor/view-part?ref=eda>; AVAILABILITY: In Stock; DESCRIPTION: N-Channel 50 V 200mA (Ta) 225mW (Ta) Surface Mount SOT-23-3 (TO-236); MF: ON Semiconductor; MP: BSS138; PACKAGE: SOT-23 ON; PRICE: None; PURCHASE-URL: https://pricing.snapeda.com/search/part/BSS138/?ref=eda
Q17-Q48 = PT19-21B_L41_TR8:PT19-21B/L41/TR8: Phototransistors 940nm Top View 0603 (1608 Metric) Check availability <https://pricing.snapeda.com/parts/PT19-21B/L41/TR8/Everlight%20Electronics/view-part?ref=eda>; AVAILABILITY: In Stock; DESCRIPTION: Phototransistors 940nm Top View 0603 (1608 Metric); MF: Everlight Electronics; MP: PT19-21B/L41/TR8; PACKAGE: 0603 Everlight; PRICE: None; PURCHASE-URL: https://pricing.snapeda.com/search/part/PT19-21B/L41/TR8/?ref=eda
Q49 Q50 Q53 = CSD19503KCS:CSD19503KCS: 80V, N ch NexFET MOSFET, single TO-220, 9.2mOhm 3-TO-220 -55 to 175 Check availability <https://pricing.snapeda.com/parts/CSD19503KCS/Texas%20Instruments/view-part?ref=eda>; AVAILABILITY: In Stock; DESCRIPTION: 80-V, N channel NexFET™ power MOSFET, single TO-220, 9.2 mOhm; MF: Texas Instruments; MP: CSD19503KCS; PACKAGE: TO-220-3 Texas Instruments; PRICE: None; PURCHASE-URL: https://pricing.snapeda.com/search/part/CSD19503KCS/?ref=eda
R1 R2 R5-R8 R65-R180 = rcl:R-EU_: RESISTOR, European symbol; SPICEPREFIX: R
R3 R4 = rcl:R-TRIMM: Trimm resistor; SPICEMODEL: X; SPICEPREFIXL: POT
TP1-TP32 = testpad:PTR1: TEST PIN
U1-U3 = BH-18650-PC:BH-18650-PC: Check availability <https://pricing.snapeda.com/parts/BH-18650-PC/MPD/view-part?ref=eda>; AVAILABILITY: In Stock; DESCRIPTION: BATTERY HOLDER 18650 PC PIN; MF: MPD; MP: BH-18650-PC; PACKAGE: None; PRICE: None; PURCHASE-URL: https://pricing.snapeda.com/search/part/BH-18650-PC/?ref=eda
U8 U9 = XL4015:XL4015: 5A 180KHz 36V Buck DC to DC Converter Check availability <https://pricing.snapeda.com/parts/XL4015/XLSEMI/view-part?ref=eda>; AVAILABILITY: Not in stock; DESCRIPTION: 5A 180KHz 36V Buck DC to DC Converter; MF: XLSEMI; MP: XL4015; PACKAGE: None; PRICE: None